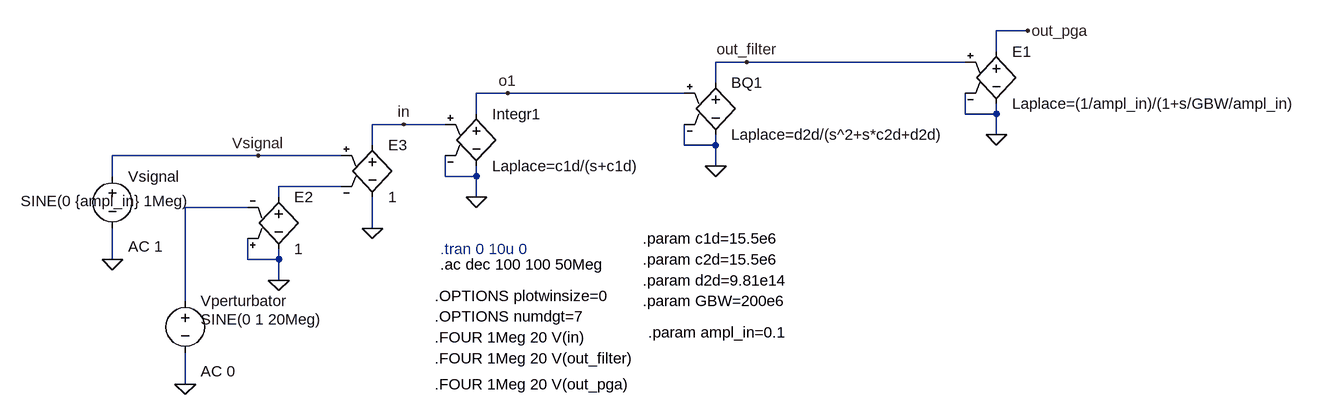
[diagram p0: schematic transient_interface.asc]
transient_interface.asc, the LTspice schematic file:
Version 4
SHEET 1 2804 1736
WIRE 2320 272 2272 272
WIRE 2272 304 2272 272
WIRE 1888 320 1840 320
WIRE 2224 320 1888 320
WIRE 1840 352 1840 320
WIRE 1520 368 1472 368
WIRE 1792 368 1520 368
WIRE 1472 400 1472 368
WIRE 2224 400 2224 368
WIRE 2272 400 2272 384
WIRE 2272 400 2224 400
WIRE 1360 416 1312 416
WIRE 1424 416 1360 416
WIRE 2272 432 2272 400
WIRE 1312 448 1312 416
WIRE 1792 448 1792 416
WIRE 1840 448 1840 432
WIRE 1840 448 1792 448
WIRE 1136 464 912 464
WIRE 1264 464 1136 464
WIRE 1840 480 1840 448
WIRE 912 496 912 464
WIRE 1424 496 1424 464
WIRE 1472 496 1472 480
WIRE 1472 496 1424 496
WIRE 1264 512 1168 512
WIRE 1168 528 1168 512
WIRE 1472 528 1472 496
WIRE 1120 544 1024 544
WIRE 1312 576 1312 528
WIRE 912 624 912 576
WIRE 1120 624 1120 592
WIRE 1168 624 1168 608
WIRE 1168 624 1120 624
WIRE 1168 656 1168 624
WIRE 1024 688 1024 544
WIRE 1024 816 1024 768
FLAG 912 624 0
FLAG 1024 816 0
FLAG 1168 656 0
FLAG 1312 576 0
FLAG 1360 416 in
FLAG 1472 528 0
FLAG 1520 368 o1
FLAG 1840 480 0
FLAG 1888 320 out_filter
FLAG 1136 464 Vsignal
FLAG 2272 432 0
FLAG 2320 272 out_pga
SYMBOL voltage 912 480 R0
WINDOW 123 24 124 Left 2
WINDOW 39 0 0 Left 0
WINDOW 3 -141 54 Left 2
SYMATTR Value2 AC 1
SYMATTR Value SINE(0 {ampl_in} 1Meg)
SYMATTR InstName Vsignal
SYMBOL voltage 1024 672 R0
WINDOW 123 24 124 Left 2
WINDOW 39 0 0 Left 0
WINDOW 3 24 44 Left 2
SYMATTR Value2 AC 0
SYMATTR Value SINE(0 1 20Meg)
SYMATTR InstName Vperturbator
SYMBOL e2 1168 512 R0
SYMATTR InstName E2
SYMATTR Value 1
SYMBOL e 1312 432 R0
SYMATTR InstName E3
SYMATTR Value 1
SYMBOL e 1472 384 R0
SYMATTR InstName Integr1
SYMATTR Value Laplace=c1d/(s+c1d)
SYMBOL e 1840 336 R0
SYMATTR InstName BQ1
SYMATTR Value Laplace=d2d/(s^2+s*c2d+d2d)
SYMBOL e 2272 288 R0
SYMATTR InstName E1
SYMATTR Value Laplace=(1/ampl_in)/(1+s/GBW/ampl_in)
TEXT 1416 632 Left 2 !.ac dec 100 100 50Meg
TEXT 1728 592 Left 2 !.param c1d=15.5e6
TEXT 1728 624 Left 2 !.param c2d=15.5e6
TEXT 1728 656 Left 2 !.param d2d=9.81e14
TEXT 1416 608 Left 2 ;.tran 0 10u 0
TEXT 1408 744 Left 2 !.FOUR 1Meg 20 V(in)
TEXT 1408 680 Left 2 !.OPTIONS plotwinsize=0
TEXT 1408 712 Left 2 !.OPTIONS numdgt=7
TEXT 1408 776 Left 2 !.FOUR 1Meg 20 V(out_filter)
TEXT 1736 736 Left 2 !.param ampl_in=0.1
TEXT 1408 816 Left 2 !.FOUR 1Meg 20 V(out_pga)
TEXT 1728 688 Left 2 !.param GBW=200e6

The netlist it stands for:
* transient_interface.asc
Vsignal Vsignal 0 SINE(0 {ampl_in} 1Meg) AC 1
Vperturbator N002 0 SINE(0 1 20Meg) AC 0
E2 N001 0 0 N002 1
E3 in 0 Vsignal N001 1
E§Integr1 o1 0 in 0 Laplace=c1d/(s+c1d)
E§BQ1 out_filter 0 o1 0 Laplace=d2d/(s^2+s*c2d+d2d)
E1 out_pga 0 out_filter 0 Laplace=(1/ampl_in)/(1+s/GBW/ampl_in)
.ac dec 100 100 50Meg
.param c1d=15.5e6
.param c2d=15.5e6
.param d2d=9.81e14
* .tran 0 10u 0
.FOUR 1Meg 20 V(in)
.OPTIONS plotwinsize=0
.OPTIONS numdgt=7
.FOUR 1Meg 20 V(out_filter)
.param ampl_in=0.1
.FOUR 1Meg 20 V(out_pga)
.param GBW=200e6
.backanno
.end